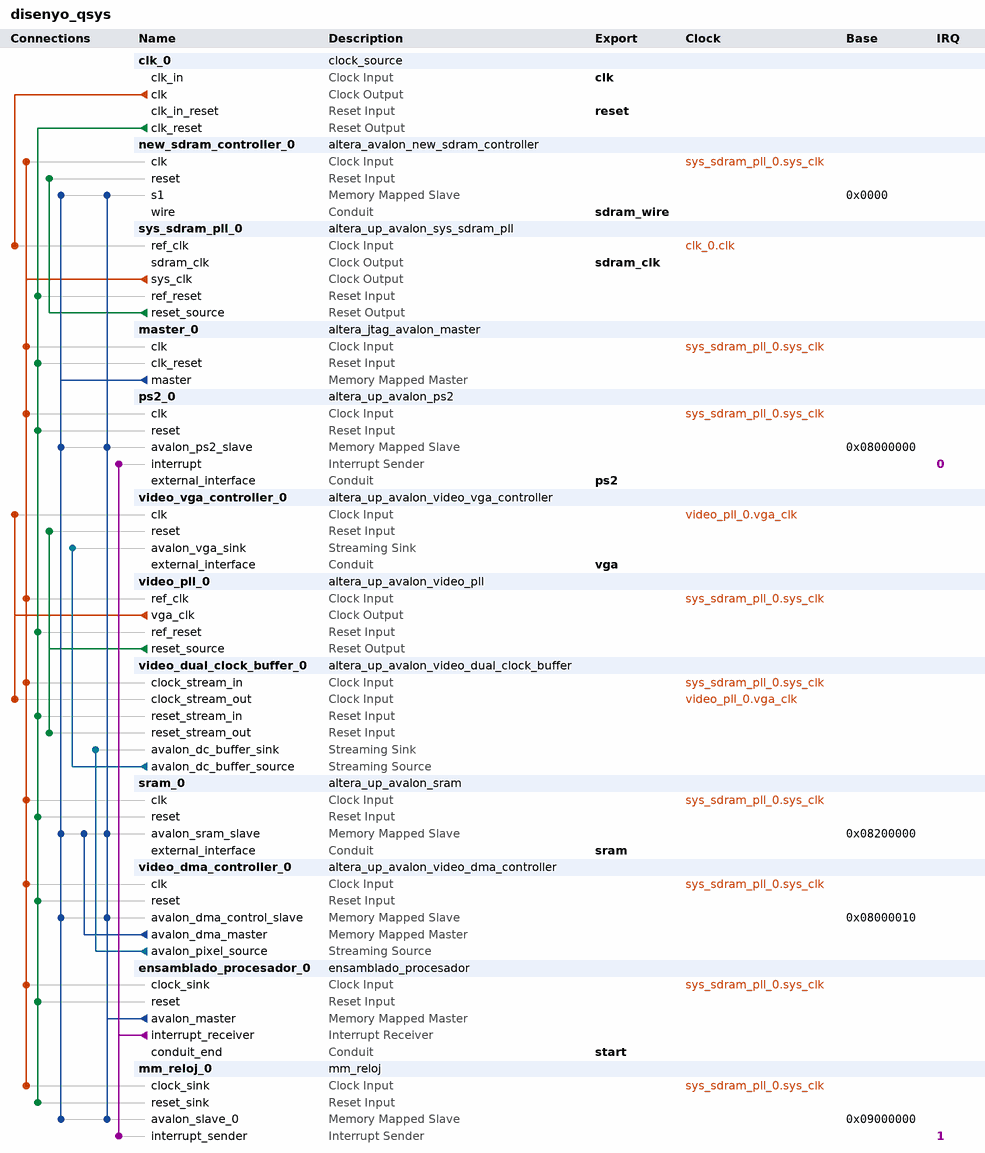
[diagram p0: system contents]
# Platform Designer (Qsys) system disenyo_qsys, Cyclone IV E EP4CE115F29C7
# Parameters at their usual value, and those the tool derives, are not listed.
package require -exact qsys 18.0
create_system disenyo_qsys
set_project_property DEVICE_FAMILY {Cyclone IV E}
set_project_property DEVICE EP4CE115F29C7

add_instance clk_0 clock_source 19.1
set_instance_parameter_value clk_0 clockFrequency 50000000

add_instance new_sdram_controller_0 altera_avalon_new_sdram_controller 19.1
set_instance_parameter_value new_sdram_controller_0 TAC 5.5
set_instance_parameter_value new_sdram_controller_0 TRCD 20.0
set_instance_parameter_value new_sdram_controller_0 TRP 20.0
set_instance_parameter_value new_sdram_controller_0 casLatency 3
set_instance_parameter_value new_sdram_controller_0 columnWidth 10
set_instance_parameter_value new_sdram_controller_0 dataWidth 32
set_instance_parameter_value new_sdram_controller_0 generateSimulationModel true
set_instance_parameter_value new_sdram_controller_0 model single_Micron_MT48LC4M32B2_7_chip
set_instance_parameter_value new_sdram_controller_0 numberOfBanks 4
set_instance_parameter_value new_sdram_controller_0 numberOfChipSelects 1
set_instance_parameter_value new_sdram_controller_0 powerUpDelay 100.0
set_instance_parameter_value new_sdram_controller_0 refreshPeriod 15.625
set_instance_parameter_value new_sdram_controller_0 rowWidth 13

add_instance sys_sdram_pll_0 altera_up_avalon_sys_sdram_pll 18.0
set_instance_parameter_value sys_sdram_pll_0 CV_boards DE10-Standard
set_instance_parameter_value sys_sdram_pll_0 gui_outclk 50.0
set_instance_parameter_value sys_sdram_pll_0 gui_refclk 50.0

add_instance master_0 altera_jtag_avalon_master 19.1

add_instance ps2_0 altera_up_avalon_ps2 18.0

add_instance video_vga_controller_0 altera_up_avalon_video_vga_controller 18.0
set_instance_parameter_value video_vga_controller_0 board DE2-115
set_instance_parameter_value video_vga_controller_0 resolution {VGA 640x480}

add_instance video_pll_0 altera_up_avalon_video_pll 18.0
set_instance_parameter_value video_pll_0 camera {5MP Digital Camera (THDB_D5M)}
set_instance_parameter_value video_pll_0 gui_refclk 50.0
set_instance_parameter_value video_pll_0 lcd {7" LCD on VEEK-MT and MTL/MTL2 Modules}

add_instance video_dual_clock_buffer_0 altera_up_avalon_video_dual_clock_buffer 18.0
set_instance_parameter_value video_dual_clock_buffer_0 color_bits 10

add_instance sram_0 altera_up_avalon_sram 18.0
set_instance_parameter_value sram_0 board DE2-115
set_instance_parameter_value sram_0 pixel_buffer true

add_instance video_dma_controller_0 altera_up_avalon_video_dma_controller 18.0
set_instance_parameter_value video_dma_controller_0 addr_mode Consecutive
set_instance_parameter_value video_dma_controller_0 back_start_address 136314880
set_instance_parameter_value video_dma_controller_0 color_bits 10
set_instance_parameter_value video_dma_controller_0 color_planes 3
set_instance_parameter_value video_dma_controller_0 dma_enabled true
set_instance_parameter_value video_dma_controller_0 height 480
set_instance_parameter_value video_dma_controller_0 mode {From Memory to Stream}
set_instance_parameter_value video_dma_controller_0 start_address 136314880
set_instance_parameter_value video_dma_controller_0 width 640

add_instance ensamblado_procesador_0 ensamblado_procesador 1.0

add_instance mm_reloj_0 mm_reloj 1.0

# connections
add_connection clk_0.clk sys_sdram_pll_0.ref_clk clock
add_connection sys_sdram_pll_0.sys_clk ensamblado_procesador_0.clock_sink clock
add_connection sys_sdram_pll_0.sys_clk master_0.clk clock
add_connection sys_sdram_pll_0.sys_clk mm_reloj_0.clock_sink clock
add_connection sys_sdram_pll_0.sys_clk new_sdram_controller_0.clk clock
add_connection sys_sdram_pll_0.sys_clk ps2_0.clk clock
add_connection sys_sdram_pll_0.sys_clk sram_0.clk clock
add_connection sys_sdram_pll_0.sys_clk video_dma_controller_0.clk clock
add_connection sys_sdram_pll_0.sys_clk video_dual_clock_buffer_0.clock_stream_in clock
add_connection sys_sdram_pll_0.sys_clk video_pll_0.ref_clk clock
add_connection video_pll_0.vga_clk video_dual_clock_buffer_0.clock_stream_out clock
add_connection video_pll_0.vga_clk video_vga_controller_0.clk clock
add_connection clk_0.clk_reset ensamblado_procesador_0.reset reset
add_connection clk_0.clk_reset master_0.clk_reset reset
add_connection clk_0.clk_reset mm_reloj_0.reset_sink reset
add_connection clk_0.clk_reset ps2_0.reset reset
add_connection clk_0.clk_reset sram_0.reset reset
add_connection clk_0.clk_reset sys_sdram_pll_0.ref_reset reset
add_connection clk_0.clk_reset video_dma_controller_0.reset reset
add_connection clk_0.clk_reset video_dual_clock_buffer_0.reset_stream_in reset
add_connection clk_0.clk_reset video_pll_0.ref_reset reset
add_connection sys_sdram_pll_0.reset_source new_sdram_controller_0.reset reset
add_connection video_pll_0.reset_source video_dual_clock_buffer_0.reset_stream_out reset
add_connection video_pll_0.reset_source video_vga_controller_0.reset reset
add_connection ensamblado_procesador_0.avalon_master mm_reloj_0.avalon_slave_0 avalon
set_connection_parameter_value ensamblado_procesador_0.avalon_master/mm_reloj_0.avalon_slave_0 baseAddress 0x09000000
add_connection ensamblado_procesador_0.avalon_master new_sdram_controller_0.s1 avalon
set_connection_parameter_value ensamblado_procesador_0.avalon_master/new_sdram_controller_0.s1 baseAddress 0x0000
add_connection ensamblado_procesador_0.avalon_master ps2_0.avalon_ps2_slave avalon
set_connection_parameter_value ensamblado_procesador_0.avalon_master/ps2_0.avalon_ps2_slave baseAddress 0x08000000
add_connection ensamblado_procesador_0.avalon_master sram_0.avalon_sram_slave avalon
set_connection_parameter_value ensamblado_procesador_0.avalon_master/sram_0.avalon_sram_slave baseAddress 0x08200000
add_connection ensamblado_procesador_0.avalon_master video_dma_controller_0.avalon_dma_control_slave avalon
set_connection_parameter_value ensamblado_procesador_0.avalon_master/video_dma_controller_0.avalon_dma_control_slave baseAddress 0x08000010
add_connection master_0.master mm_reloj_0.avalon_slave_0 avalon
set_connection_parameter_value master_0.master/mm_reloj_0.avalon_slave_0 baseAddress 0x09000000
add_connection master_0.master new_sdram_controller_0.s1 avalon
set_connection_parameter_value master_0.master/new_sdram_controller_0.s1 baseAddress 0x0000
add_connection master_0.master ps2_0.avalon_ps2_slave avalon
set_connection_parameter_value master_0.master/ps2_0.avalon_ps2_slave baseAddress 0x08000000
add_connection master_0.master sram_0.avalon_sram_slave avalon
set_connection_parameter_value master_0.master/sram_0.avalon_sram_slave baseAddress 0x08200000
add_connection master_0.master video_dma_controller_0.avalon_dma_control_slave avalon
set_connection_parameter_value master_0.master/video_dma_controller_0.avalon_dma_control_slave baseAddress 0x08000010
add_connection video_dma_controller_0.avalon_dma_master sram_0.avalon_sram_slave avalon
set_connection_parameter_value video_dma_controller_0.avalon_dma_master/sram_0.avalon_sram_slave baseAddress 0x08200000
add_connection video_dma_controller_0.avalon_pixel_source video_dual_clock_buffer_0.avalon_dc_buffer_sink avalon_streaming
add_connection video_dual_clock_buffer_0.avalon_dc_buffer_source video_vga_controller_0.avalon_vga_sink avalon_streaming
add_connection ensamblado_procesador_0.interrupt_receiver mm_reloj_0.interrupt_sender interrupt
set_connection_parameter_value ensamblado_procesador_0.interrupt_receiver/mm_reloj_0.interrupt_sender irqNumber 1
add_connection ensamblado_procesador_0.interrupt_receiver ps2_0.interrupt interrupt
set_connection_parameter_value ensamblado_procesador_0.interrupt_receiver/ps2_0.interrupt irqNumber 0

# exported interfaces
add_interface clk clock sink
set_interface_property clk EXPORT_OF clk_0.clk_in
add_interface ps2 conduit end
set_interface_property ps2 EXPORT_OF ps2_0.external_interface
add_interface reset reset sink
set_interface_property reset EXPORT_OF clk_0.clk_in_reset
add_interface sdram_clk clock source
set_interface_property sdram_clk EXPORT_OF sys_sdram_pll_0.sdram_clk
add_interface sdram_wire conduit end
set_interface_property sdram_wire EXPORT_OF new_sdram_controller_0.wire
add_interface sram conduit end
set_interface_property sram EXPORT_OF sram_0.external_interface
add_interface start conduit end
set_interface_property start EXPORT_OF ensamblado_procesador_0.conduit_end
add_interface vga conduit end
set_interface_property vga EXPORT_OF video_vga_controller_0.external_interface

set_interconnect_requirement {$system} qsys_mm.clockCrossingAdapter HANDSHAKE
set_interconnect_requirement {$system} qsys_mm.enableEccProtection FALSE
set_interconnect_requirement {$system} qsys_mm.insertDefaultSlave FALSE
set_interconnect_requirement {$system} qsys_mm.maxAdditionalLatency 1
set_interconnect_requirement {mm_interconnect_0|ps2_0_avalon_ps2_slave_agent.rp/router_005.sink} qsys_mm.postTransform.pipelineCount 0
set_interconnect_requirement {mm_interconnect_0|router_003.src/sram_0_avalon_sram_slave_rsp_width_adapter.sink} qsys_mm.postTransform.pipelineCount 1
set_interconnect_requirement {mm_interconnect_0|router_004.src/rsp_demux_001.sink} qsys_mm.postTransform.pipelineCount 1
set_interconnect_requirement {mm_interconnect_0|router_005.src/rsp_demux_002.sink} qsys_mm.postTransform.pipelineCount 1
set_interconnect_requirement {mm_interconnect_0|router_006.src/rsp_demux_003.sink} qsys_mm.postTransform.pipelineCount 1
set_interconnect_requirement {mm_interconnect_0|router_007.src/rsp_demux_004.sink} qsys_mm.postTransform.pipelineCount 1
set_interconnect_requirement {mm_interconnect_0|video_dma_controller_0_avalon_dma_control_slave_agent.rp/router_004.sink} qsys_mm.postTransform.pipelineCount 0

save_system disenyo_qsys.qsys
